# Altium schematic sheet [08] - COMMUNICATION.SchDoc: X
size A4; Date: DD-MM-YYYY; CheckedBy: X; DrawnBy: Y; Revision: 0.0.0; SheetNumber: X; SheetTotal: Y; Projectnumber: OWN-000; Size: A4; Projectname: X
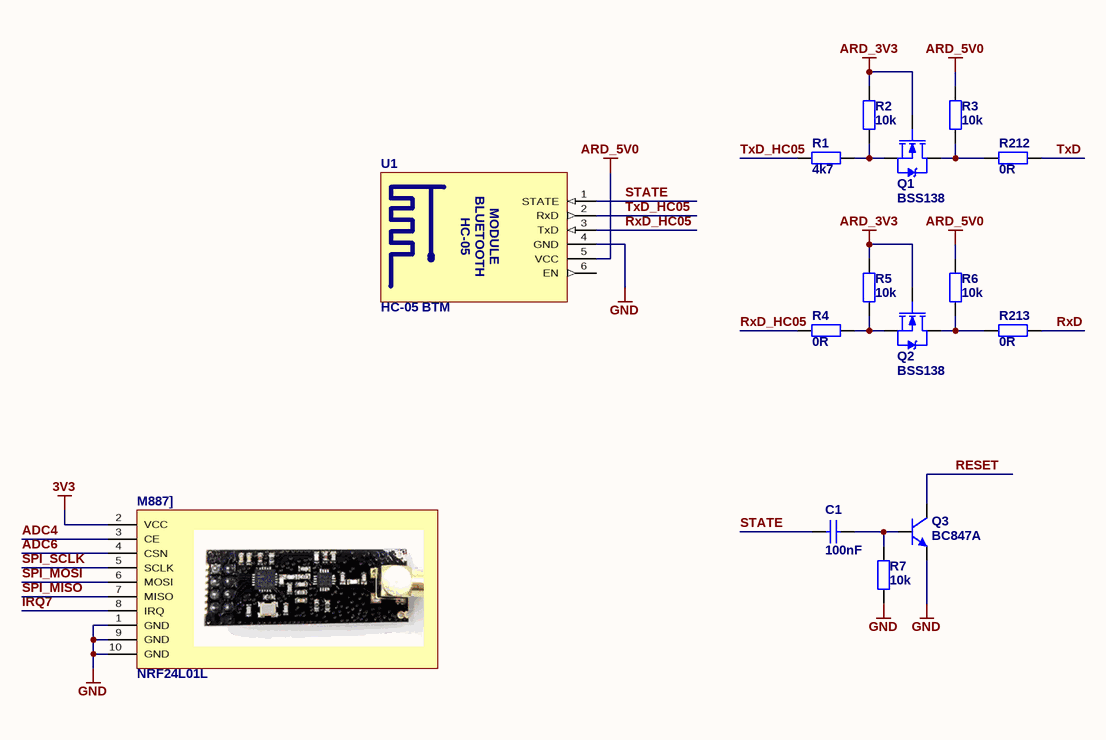
[diagram p0: [08] - COMMUNICATION.SchDoc]

## Parts
C1  100nF  [C0805]
M887]  NRF24L01L  [NRF24L01L]
Q1  BSS138  [SOT-23]
Q2  BSS138  [SOT-23]
Q3  BC847A  [SOT-23]
R1  4k7  [R0805]
R2  10k  [R0805]
R3  10k  [R0805]
R4  0R  [R0805]
R5  10k  [R0805]
R6  10k  [R0805]
R7  10k  [R0805]
R212  0R  [R0805]
R213  0R  [R0805]
U1  HC-05 BTM  [HC-05_H]

## Nets
3V3: M887].2(VCC)
ARD_3V3: Q1.1(G) Q2.1(G) R2.1 R5.1
ARD_5V0: R3.1 R6.1 U1.5(VCC)
GND: M887].1(GND) M887].9(GND) M887].10(GND) Q3.2(E) R7.2 U1.4(GND)
ADC4: M887].3(CE)
ADC6: M887].4(CSN)
IRQ7: M887].8(IRQ)
RESET: Q3.3(C)
RxD: R213.2
RxD_HC05: R4.1 U1.3(TxD)
SPI_MISO: M887].7(MISO)
SPI_MOSI: M887].6(MOSI)
SPI_SCLK: M887].5(SCLK)
STATE: C1.1 U1.1(STATE)
TxD: R212.2
TxD_HC05: R1.1 U1.2(RxD)
NetC1_2: C1.2 Q3.1(B) R7.1
NetQ1_2: Q1.2(S) R1.2 R2.2
NetQ1_3: Q1.3(D) R3.2 R212.1
NetQ2_2: Q2.2(S) R4.2 R5.2
NetQ2_3: Q2.3(D) R6.2 R213.1

Not connected (* = marked no-connect by the designer): U1 6(EN)

## Notes on the sheet
- REV:
- A  P  P  R  O  V  E  D
- /
- Lodz University of Technology
- ul. Wolczanska 211/215
- 90-924 LODZ, POLAND
- Institute of Electronics
- Project name:
- Title:
- Author:
- Verified by:
- (in symbol HC-05_BTM) HC-05; BLUETOOTH; MODULE

## Library data of the parts
C1 = Cap: Capacitor; ComponentLink1Description: datasheet; ComponentLink2Description: supplier; Value: 100nF
M887] = NRF24L01L: Long Range Wireless Module R2 (1.1KM, PA+SMA)
Q1 Q2 = BSS138: N-Channel Enhancement Mode Vertical DMOS FET; Published: 17-Dec-2003; DatasheetVersion: Mar-96; PackageVersion: 1996; PackageReference: SOT23; Publisher: Altium Limited; PackageDescription: SOT-23; 3 Leads; Body 3.1 x 2.5 mm, inc. leads (LxW max), Alternate Lead Configuration; ComponentLink1Description: Manufacturer Link; ComponentLink1URL: http://www.zetex.com/; ComponentLink2Description: Datasheet; ComponentLink2URL: www.zetex.com/3.0/pdf/BSS138.pdf
Q3 = BC847A: NPN General Purpose Transistor (VCE=45V, IC=100mA, HFE=110-220); PowerRating: 250mW; VCEO: 45V; IC: 100mA; Supplier 1: TME; Supplier 2: Farnell; Supplier 3: Farnell; Supplier 4: Farnell; Supplier 5: Farnell; Supplier Part Number 1: BC847A-DIO; Supplier Part Number 2: 1081231; Supplier Part Number 3: 1081231RL; Supplier Part Number 4: 1459037RL; Supplier Part Number 5: 1459037; HFE: 110-220
R1-R7 R212 R213 = Res: Resistor; Published: 19-Feb-2006; ComponentLink1Description: datasheet; ComponentLink2Description: supplier
  R1: Value: 4k7
  R2 R3 R5-R7: Value: 10k
  R4 R212 R213: Value: 0R
U1 = HC-05_BTM: HC-05 Bluetooth Module